# EAGLE schematic ESpdesign (EAGLE 9.6.2)
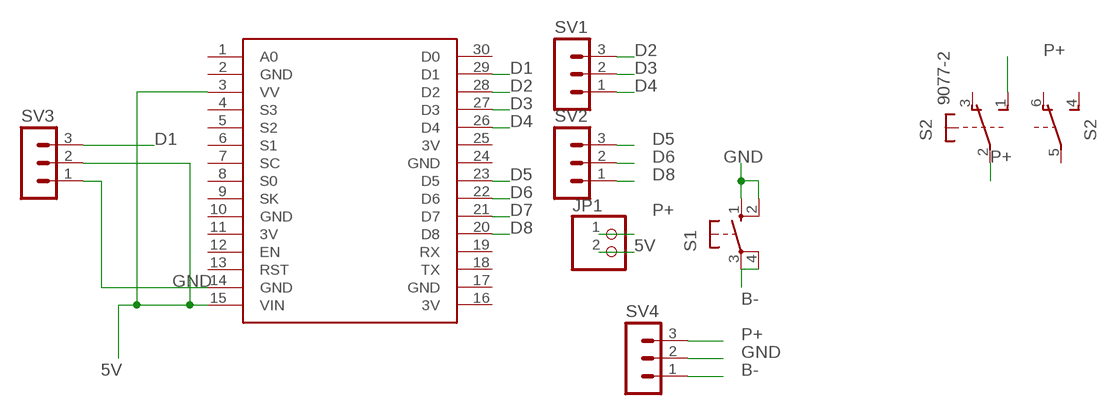
[diagram p0: schematic, sheet 1]

## Parts
JP1  PINHD-1X2  [1X02]
S1  10-XX  [B3F-10XX]
S2  9077-2  [9077-2]
SV1  MA03-1  [MA03-1]
SV2  MA03-1  [MA03-1]
SV3  MA03-1  [MA03-1]
SV4  MA03-1  [MA03-1]
U$1  NODEMCU  [NODEMCU]

## Nets
5V: JP1.2 SV3.2 U$1.3(VV) U$1.15(VIN)
B-: S1.3(P) S1.4(P1) SV4.1
D1: SV3.3 U$1.29(D1)
D2: SV1.3 U$1.28(D2)
D3: SV1.2 U$1.27(D3)
D4: SV1.1 U$1.26(D4)
D5: SV2.3 U$1.23(D5)
D6: SV2.2 U$1.22(D6)
D7: U$1.21(D7)
D8: SV2.1 U$1.20(D8)
GND: S1.1(S) S1.2(S1) SV3.1 SV4.2 U$1.14(GND)
P+: JP1.1 S2.1(1:S) S2.2(1:P) SV4.3
Unconnected: S2.3(1:O) S2.4(2:S) S2.5(2:P) S2.6(2:O) U$1.1(A0) U$1.4(S3) U$1.5(S2) U$1.6(S1) U$1.7(SC) U$1.8(S0) U$1.9(SK) U$1.12(EN) U$1.13(RST) U$1.18(TX) U$1.19(RX) U$1.30(D0)

## Power pins joined to a net without a drawn wire
3V: U$1.11(3V) U$1.16(3V) U$1.25(3V)
GND: U$1.2(GND) U$1.10(GND) U$1.17(GND) U$1.24(GND)

## Library data of the parts
JP1 = pinhead:PINHD-1X2: PIN HEADER
S1 = switch-omron:10-XX: OMRON SWITCH; MPN: B3F-1000; OC_FARNELL: 176432; OC_NEWARK: 36M3542
S2 = switch-misc-edited:9077-2: MARQUARDT SWITCH 9077.0200 Distributor: Buerklin <https://www.buerklin.com/default.asp?event=ShowArtikel%2812G2822%29&l=d&jump=ArtNr_12G2822>
SV1-SV4 = con-lstb:MA03-1: PIN HEADER; OC_FARNELL: unknown; OC_NEWARK: unknown
U$1 = nodemcu:NODEMCU